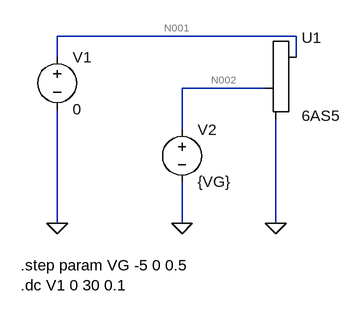
[diagram p0: schematic Circuit_6AS5.asc]
Circuit_6AS5.asc, the LTspice schematic file:
Version 4
SHEET 1 880 680
WIRE 400 208 32 208
WIRE 32 240 32 208
WIRE 400 240 400 208
WIRE 352 288 224 288
WIRE 224 352 224 288
WIRE 32 496 32 320
WIRE 224 496 224 432
WIRE 368 496 368 336
FLAG 368 496 0
FLAG 224 496 0
FLAG 32 496 0
SYMBOL voltage 32 224 R0
SYMATTR InstName V1
SYMATTR Value 0
SYMBOL voltage 224 336 R0
SYMATTR InstName V2
SYMATTR Value {VG}
SYMBOL MyTubeModel/6AS5 400 288 R0
SYMATTR InstName U1
TEXT -24 560 Left 2 !.step param VG -5 0 0.5\n.dc V1 0 30 0.1

The netlist it stands for:
* Circuit_6AS5.asc
V1 N001 0 0
V2 N002 0 {VG}
XU1 N001 N002 0 6AS5
.step param VG -5 0 0.5
.dc V1 0 30 0.1
.lib 6AS5.sub
.backanno
.end

* Results of the author's LTspice run, read from the files saved beside the schematic
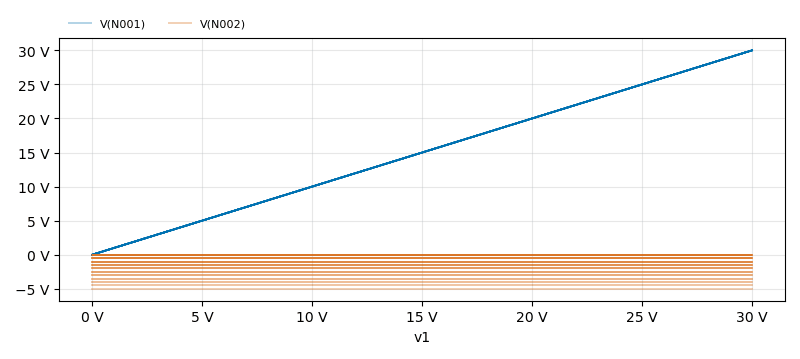
[diagram p1: DC transfer characteristic of Circuit_6AS5.asc, plotted from the saved traces]
* DC transfer characteristic, 11 runs:
*   V(N001) [vg=-5]: 0 V at v1=0 V, 30 V at v1=30 V, min 0 V, max 30 V
*   V(N001) [vg=-4.5]: 0 V at v1=0 V, 30 V at v1=30 V, min 0 V, max 30 V
*   V(N001) [vg=-4]: 0 V at v1=0 V, 30 V at v1=30 V, min 0 V, max 30 V
*   V(N001) [vg=-3.5]: 0 V at v1=0 V, 30 V at v1=30 V, min 0 V, max 30 V
*   V(N001) [vg=-3]: 0 V at v1=0 V, 30 V at v1=30 V, min 0 V, max 30 V
*   V(N001) [vg=-2.5]: 0 V at v1=0 V, 30 V at v1=30 V, min 0 V, max 30 V
*   V(N001) [vg=-2]: 0 V at v1=0 V, 30 V at v1=30 V, min 0 V, max 30 V
*   V(N001) [vg=-1.5]: 0 V at v1=0 V, 30 V at v1=30 V, min 0 V, max 30 V
*   V(N002) [vg=-5]: -5 V at v1=0 V, -5 V at v1=30 V, min -5 V, max -5 V
*   V(N002) [vg=-4.5]: -4.5 V at v1=0 V, -4.5 V at v1=30 V, min -4.5 V, max -4.5 V
*   V(N002) [vg=-4]: -4 V at v1=0 V, -4 V at v1=30 V, min -4 V, max -4 V
*   V(N002) [vg=-3.5]: -3.5 V at v1=0 V, -3.5 V at v1=30 V, min -3.5 V, max -3.5 V
*   V(N002) [vg=-3]: -3 V at v1=0 V, -3 V at v1=30 V, min -3 V, max -3 V
*   V(N002) [vg=-2.5]: -2.5 V at v1=0 V, -2.5 V at v1=30 V, min -2.5 V, max -2.5 V
*   V(N002) [vg=-2]: -2 V at v1=0 V, -2 V at v1=30 V, min -2 V, max -2 V
*   V(N002) [vg=-1.5]: -1.5 V at v1=0 V, -1.5 V at v1=30 V, min -1.5 V, max -1.5 V